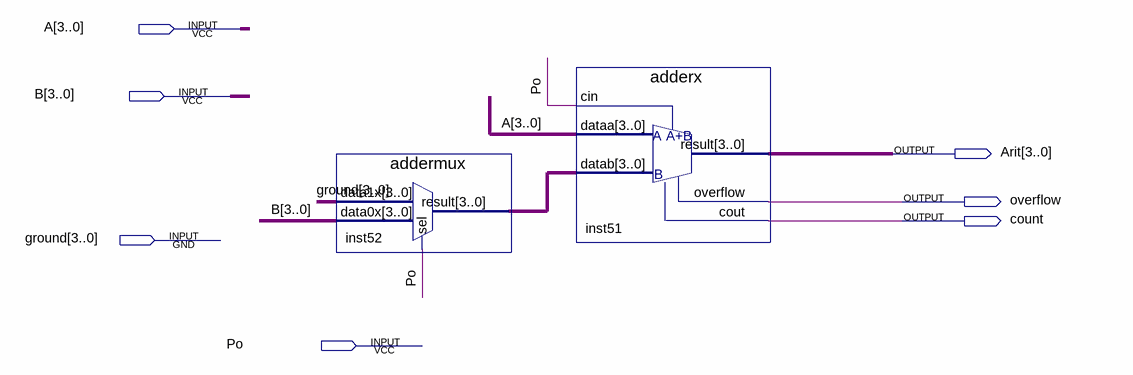
[diagram p0: schematic sheet]
// Quartus schematic AritUnit.bdf as structural Verilog: 2 symbols, 7 pins
module AritUnit (
  input  [3:0] A,
  input  [3:0] B,
  input  [3:0] ground,
  input  Po,
  output [3:0] Arit,
  output overflow,
  output count
);

  wire [3:0] inst52_result;

  addermux inst52 (.data1x(ground), .data0x(B), .sel(Po), .result(inst52_result));
  adderx inst51 (.cin(Po), .dataa(A), .datab(inst52_result), .result(Arit), .overflow(overflow), .cout(count));
endmodule
